# Altium schematic sheet ETHERNET.SchDoc
size A3
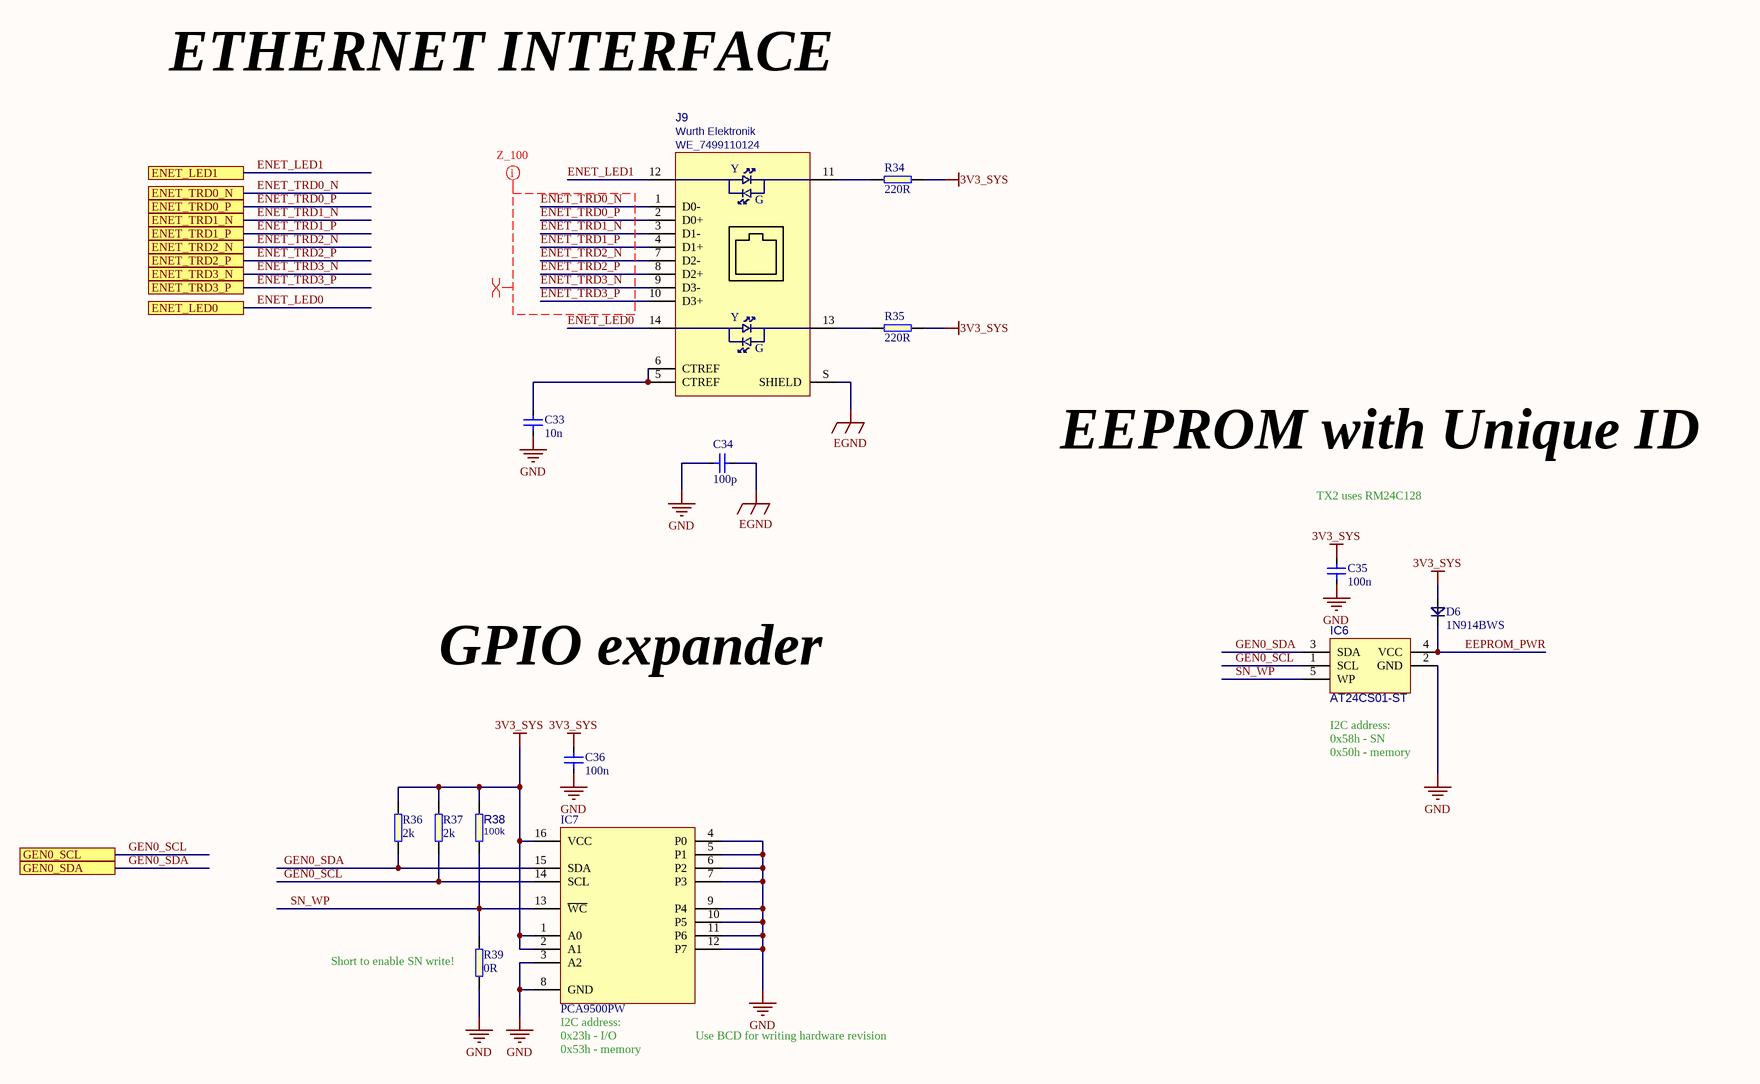
[diagram p0: ETHERNET.SchDoc]

## Parts
C33  10n  [C0402]
C34  100p  [0805]
C35  100n  [C0402]
C36  100n  [C0402]
D6  1N914BWS  [SOD-323]
IC6  AT24CS01-ST  [SOT23-5]
IC7  PCA9500PW  [TSSOP-16]
J9  Manufacturer: Wurth Elektronik  [WE_7499110124]  (hidden comment: WE_7499110124)
R34  220R  [R0402]
R35  220R  [R0402]
R36  2k  [R0402]
R37  2k  [R0402]
R38  100k  [R0402]
R39  0R  [R0402]

## Ports
ENET_LED0, ENET_LED1, ENET_TRD0_N, ENET_TRD0_P, ENET_TRD1_N, ENET_TRD1_P, ENET_TRD2_N, ENET_TRD2_P, ENET_TRD3_N, ENET_TRD3_P, GEN0_SCL, GEN0_SDA

## Nets
3V3_SYS: C35.2 C36.2 D6.A IC7.1(A0) IC7.2(A1) IC7.16(VCC) R34.2 R35.2 R36.2 R37.2 R38.1
EGND: C34.2 J9.S(SHIELD)
GND: C33.1 C34.1 C35.1 C36.1 IC6.2(GND) IC7.3(A2) IC7.4(P0) IC7.5(P1) IC7.6(P2) IC7.7(P3) IC7.8(GND) IC7.9(P4) IC7.10(P5) IC7.11(P6) IC7.12(P7) R39.1
EEPROM_PWR: D6.C IC6.4(VCC)
ENET_LED0: J9.14 ; port ENET_LED0
ENET_LED1: J9.12 ; port ENET_LED1
ENET_TRD0_N: J9.1(D0-) ; port ENET_TRD0_N
ENET_TRD0_P: J9.2(D0+) ; port ENET_TRD0_P
ENET_TRD1_N: J9.3(D1-) ; port ENET_TRD1_N
ENET_TRD1_P: J9.4(D1+) ; port ENET_TRD1_P
ENET_TRD2_N: J9.7(D2-) ; port ENET_TRD2_N
ENET_TRD2_P: J9.8(D2+) ; port ENET_TRD2_P
ENET_TRD3_N: J9.9(D3-) ; port ENET_TRD3_N
ENET_TRD3_P: J9.10(D3+) ; port ENET_TRD3_P
GEN0_SCL: IC6.1(SCL) IC7.14(SCL) R37.1 ; port GEN0_SCL
GEN0_SDA: IC6.3(SDA) IC7.15(SDA) R36.1 ; port GEN0_SDA
SN_WP: IC6.5(WP) IC7.13(~{WC}) R38.2 R39.2
NetC33_2: C33.2 J9.5(CTREF) J9.6(CTREF)
NetJ9_11: J9.11 R34.1
NetJ9_13: J9.13 R35.1

## Layout directives
net class Z_100: ENET_TRD0_N, ENET_TRD0_P, ENET_TRD1_N, ENET_TRD1_P, ENET_TRD2_N, ENET_TRD2_P, ENET_TRD3_N, ENET_TRD3_P
differential pair: ENET_TRD0_N, ENET_TRD0_P, ENET_TRD1_N, ENET_TRD1_P, ENET_TRD2_N, ENET_TRD2_P, ENET_TRD3_N, ENET_TRD3_P

## Notes on the sheet
- ETHERNET INTERFACE
- EEPROM with Unique ID
- TX2 uses RM24C128
- GPIO expander
- 0x58h - SN
- (near IC6) I2C address:
- 0x50h - memory
- (near R39) Short to enable SN write!
- (near IC7) 0x23h - I/O
- (near IC7) I2C address:
- 0x53h - memory
- (near IC7) Use BCD for writing hardware revision
- Title
- Size:
- Date:
- A3
- Number:
- Time:
- Revision:
- Sheet
- of
- Go360.io
- (in symbol WE_7499111447) Y; G

## Library data of the parts
C33 = C_10n_0402: MLCC SMT Capacitor 10 nF 0402; Manufacturer: AVX; PartSymbol: 04025G103ZAT2A; PartNumber: C_10n_0402; Value: 10n
C34 = C_47u_0805: MLCC SMT Capacitor 100pF 0805; PartNumber: C_100p_0805; PartSymbol: 08051A101JAT2A; Value: 100p
C35 C36 = C_100n_0402: MLCC SMT Capacitor 100n 0402; Manufacturer: TDK; PartSymbol: C1005X5R0J104K050BA; PartNumber: C_100n_0402; Value: 100n
D6 = diode: Diode small signal; Manufacturer: ON SEMICONDUCTOR; PartNumber: 1N914BWS; Value: 1N914BWS; PartSymbol: 1N914BWS
IC6 = AT24CS01: Manufacturer: Atmel; PartNumber: AT24CS01-ST; PartSymbol: AT24CS01-ST; Value: AT24CS01-ST
IC7 = PCA9500PW: Remote 8bit I2C SMBus I/O expander w/ 2kbit EEPROM memory; Manufacturer: NXP Semicondutors; PartNumber: PCA9500PW; Value: PCA9500PW; PartSymbol: PCA9500PW
J9 = WE_7499111447: LAN-Transformer WE-RJ45LAN 10/100/1000 BaseT; PartNumber: WE_7499110124; Value: WE_7499110124; PartSymbol: WE_7499110124
R34 R35 = R_220R_0402: RES, 220R, 0402; Manufacturer: TE CONECTIVITY; PartSymbol: CRG0402J220R; PartNumber: R_220R_0402; Value: 220R
R36 R37 = R_2k_0402: RES, 2k, 0402; Manufacturer: VISHAY; PartSymbol: CRCW04022K00FKED; PartNumber: R_2k_0402; Value: 2k
R38 = R_100k_0402: SMT Resistor 100k 0402; Manufacturer: VISHAY; PartSymbol: CRCW0402100KFKEDHP; Tolerance: 1%; PartNumber: R_100k_0402; Value: 100k
R39 = R_0R_0402: RES, 0R, 0402; Manufacturer: Panasonic; PartSymbol: ERJ2GE0R00X; PartNumber: R_0R_0402; Value: 0R